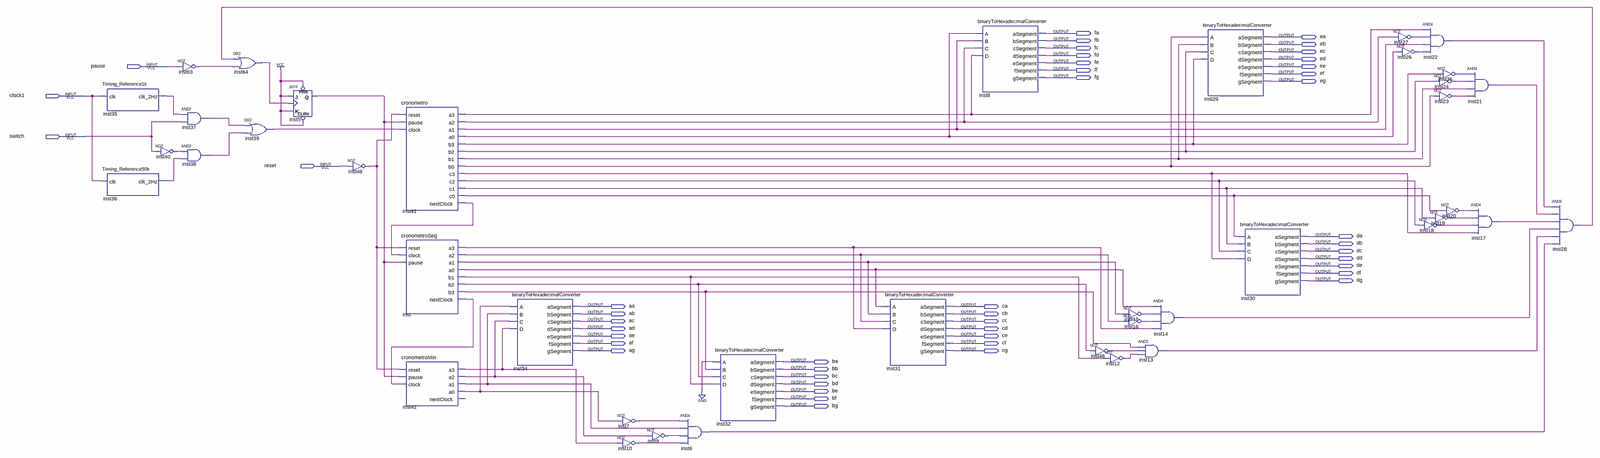
[diagram p0: schematic sheet, whole]
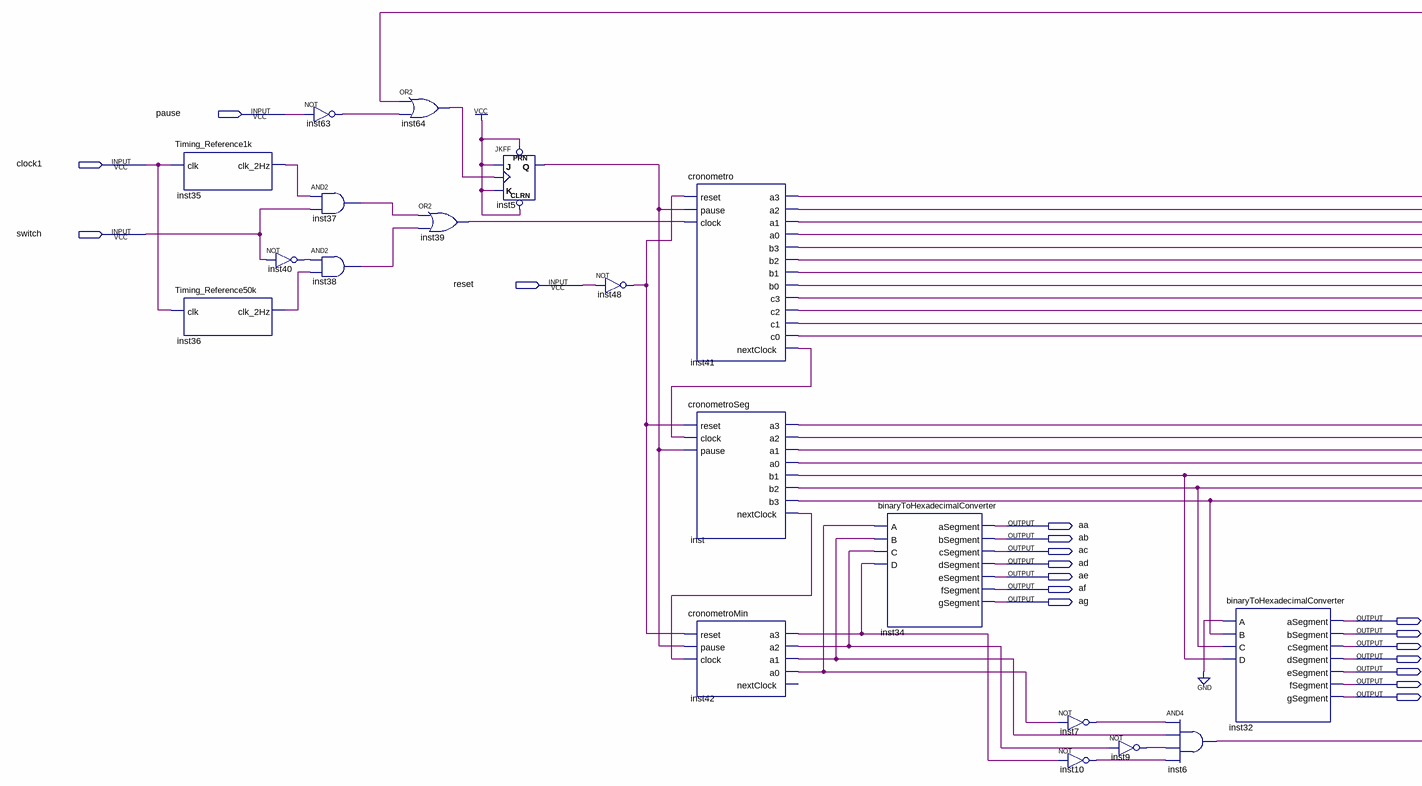
[diagram p1: schematic sheet, left part]
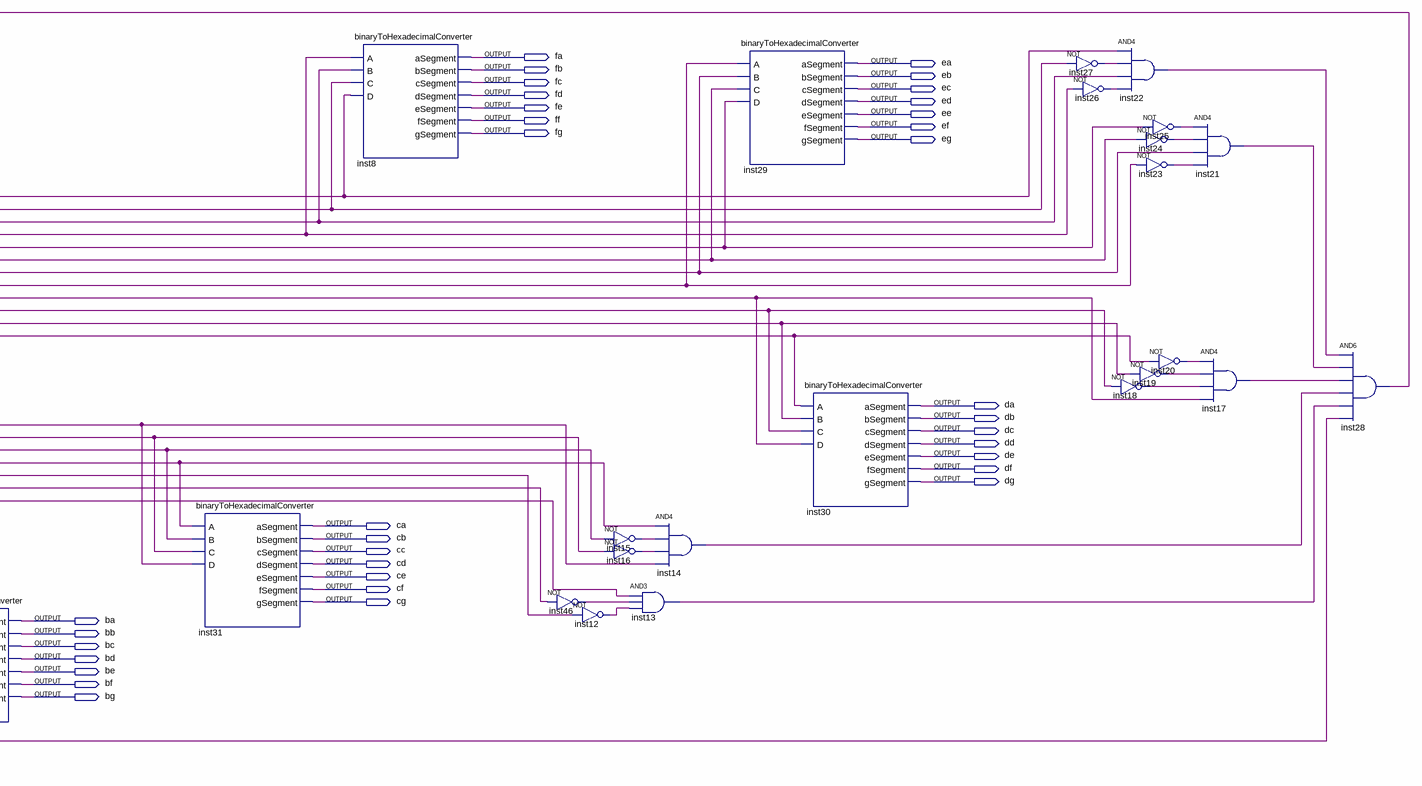
[diagram p2: schematic sheet, right part]
// Quartus schematic cronometroFull.bdf as structural Verilog: 41 symbols, 46 pins
module cronometroFull (
  input  pause,
  input  clock1,
  input  switch,
  input  reset,
  output fa,
  output ea,
  output fb,
  output eb,
  output fc,
  output ec,
  output fd,
  output ed,
  output fe,
  output ee,
  output ff,
  output ef,
  output fg,
  output eg,
  output da,
  output db,
  output dc,
  output dd,
  output de,
  output df,
  output dg,
  output aa,
  output ca,
  output ab,
  output cb,
  output ac,
  output cc,
  output ad,
  output cd,
  output ae,
  output ce,
  output af,
  output cf,
  output ag,
  output cg,
  output ba,
  output bb,
  output bc,
  output bd,
  output be,
  output bf,
  output bg
);

  wire inst5_q, inst6_out, inst7_out, inst9_out, inst10_out, inst12_out, inst13_out, inst14_out, inst15_out,
       inst16_out, inst17_out, inst18_out, inst19_out, inst20_out, inst21_out, inst22_out, inst23_out,
       inst24_out, inst25_out, inst26_out, inst27_out, inst28_out, inst35_clk_2hz, inst36_clk_2hz,
       inst37_out, inst38_out, inst39_out, inst40_out, inst41_a0, inst41_a1, inst41_a2, inst41_a3, inst41_b0,
       inst41_b1, inst41_b2, inst41_b3, inst41_c0, inst41_c1, inst41_c2, inst41_c3, inst41_nextclock,
       inst42_a0, inst42_a1, inst42_a2, inst42_a3, inst46_out, inst48_out, inst63_out, inst64_out, inst_a0,
       inst_a1, inst_a2, inst_a3, inst_b1, inst_b2, inst_b3, inst_nextclock;

  Timing_Reference1k inst35 (.clk(clock1), .clk_2Hz(inst35_clk_2hz));
  Timing_Reference50k inst36 (.clk(clock1), .clk_2Hz(inst36_clk_2hz));
  not inst63 (inst63_out, pause);
  and inst37 (inst37_out, inst35_clk_2hz, switch);
  and inst38 (inst38_out, inst40_out, inst36_clk_2hz);
  not inst40 (inst40_out, switch);
  or inst64 (inst64_out, inst28_out, inst63_out);
  or inst39 (inst39_out, inst37_out, inst38_out);
  JKFF inst5 (.PRN(1'b1), .CLRN(1'b1), .K(1'b1), .J(1'b1), .CLK(inst64_out), .Q(inst5_q));
  not inst48 (inst48_out, reset);
  cronometro inst41 (
    .reset(inst48_out), .pause(inst5_q), .clock(inst39_out), .a3(inst41_a3), .a2(inst41_a2), .a1(inst41_a1),
    .a0(inst41_a0), .b3(inst41_b3), .b2(inst41_b2), .b1(inst41_b1), .b0(inst41_b0), .c3(inst41_c3),
    .c2(inst41_c2), .c1(inst41_c1), .c0(inst41_c0), .nextClock(inst41_nextclock));
  cronometroSeg inst (
    .reset(inst48_out), .clock(inst41_nextclock), .pause(inst5_q), .a3(inst_a3), .a2(inst_a2), .a1(inst_a1),
    .a0(inst_a0), .b1(inst_b1), .b2(inst_b2), .b3(inst_b3), .nextClock(inst_nextclock));
  cronometroMin inst42 (
    .reset(inst48_out), .pause(inst5_q), .clock(inst_nextclock), .a3(inst42_a3), .a2(inst42_a2),
    .a1(inst42_a1), .a0(inst42_a0));  // open: nextClock
  binaryToHexadecimalConverter inst34 (
    .A(inst42_a0), .B(inst42_a1), .C(inst42_a2), .D(inst42_a3), .aSegment(aa), .bSegment(ab), .cSegment(ac),
    .dSegment(ad), .eSegment(ae), .fSegment(af), .gSegment(ag));
  not inst7 (inst7_out, inst42_a0);
  not inst10 (inst10_out, inst42_a3);
  not inst9 (inst9_out, inst42_a2);
  and inst6 (inst6_out, inst7_out, inst42_a1, inst9_out, inst10_out);
  binaryToHexadecimalConverter inst32 (
    .A(1'b0), .B(inst_b3), .C(inst_b2), .D(inst_b1), .aSegment(ba), .bSegment(bb), .cSegment(bc),
    .dSegment(bd), .eSegment(be), .fSegment(bf), .gSegment(bg));
  binaryToHexadecimalConverter inst31 (
    .A(inst_a0), .B(inst_a1), .C(inst_a2), .D(inst_a3), .aSegment(ca), .bSegment(cb), .cSegment(cc),
    .dSegment(cd), .eSegment(ce), .fSegment(cf), .gSegment(cg));
  binaryToHexadecimalConverter inst8 (
    .A(inst41_a0), .B(inst41_a1), .C(inst41_a2), .D(inst41_a3), .aSegment(fa), .bSegment(fb), .cSegment(fc),
    .dSegment(fd), .eSegment(fe), .fSegment(ff), .gSegment(fg));
  not inst46 (inst46_out, inst_b2);
  not inst15 (inst15_out, inst_a1);
  not inst16 (inst16_out, inst_a2);
  not inst12 (inst12_out, inst_b1);
  and inst14 (inst14_out, inst_a0, inst15_out, inst16_out, inst_a3);
  and inst13 (inst13_out, inst_b3, inst46_out, inst12_out);
  binaryToHexadecimalConverter inst29 (
    .A(inst41_b0), .B(inst41_b1), .C(inst41_b2), .D(inst41_b3), .aSegment(ea), .bSegment(eb), .cSegment(ec),
    .dSegment(ed), .eSegment(ee), .fSegment(ef), .gSegment(eg));
  binaryToHexadecimalConverter inst30 (
    .A(inst41_c0), .B(inst41_c1), .C(inst41_c2), .D(inst41_c3), .aSegment(da), .bSegment(db), .cSegment(dc),
    .dSegment(dd), .eSegment(de), .fSegment(df), .gSegment(dg));
  not inst27 (inst27_out, inst41_a2);
  and inst22 (inst22_out, inst41_a3, inst27_out, inst41_a1, inst26_out);
  not inst26 (inst26_out, inst41_a0);
  not inst18 (inst18_out, inst41_c2);
  not inst25 (inst25_out, inst41_b3);
  not inst24 (inst24_out, inst41_b2);
  not inst23 (inst23_out, inst41_b0);
  not inst20 (inst20_out, inst41_c0);
  not inst19 (inst19_out, inst41_c1);
  and inst21 (inst21_out, inst25_out, inst24_out, inst41_b1, inst23_out);
  and inst17 (inst17_out, inst20_out, inst19_out, inst18_out, inst41_c3);
  and inst28 (inst28_out, inst22_out, inst21_out, inst17_out, inst14_out, inst13_out, inst6_out);
endmodule
